# EAGLE design UCirKitUserStudy4-3 (EAGLE 7.3.0)
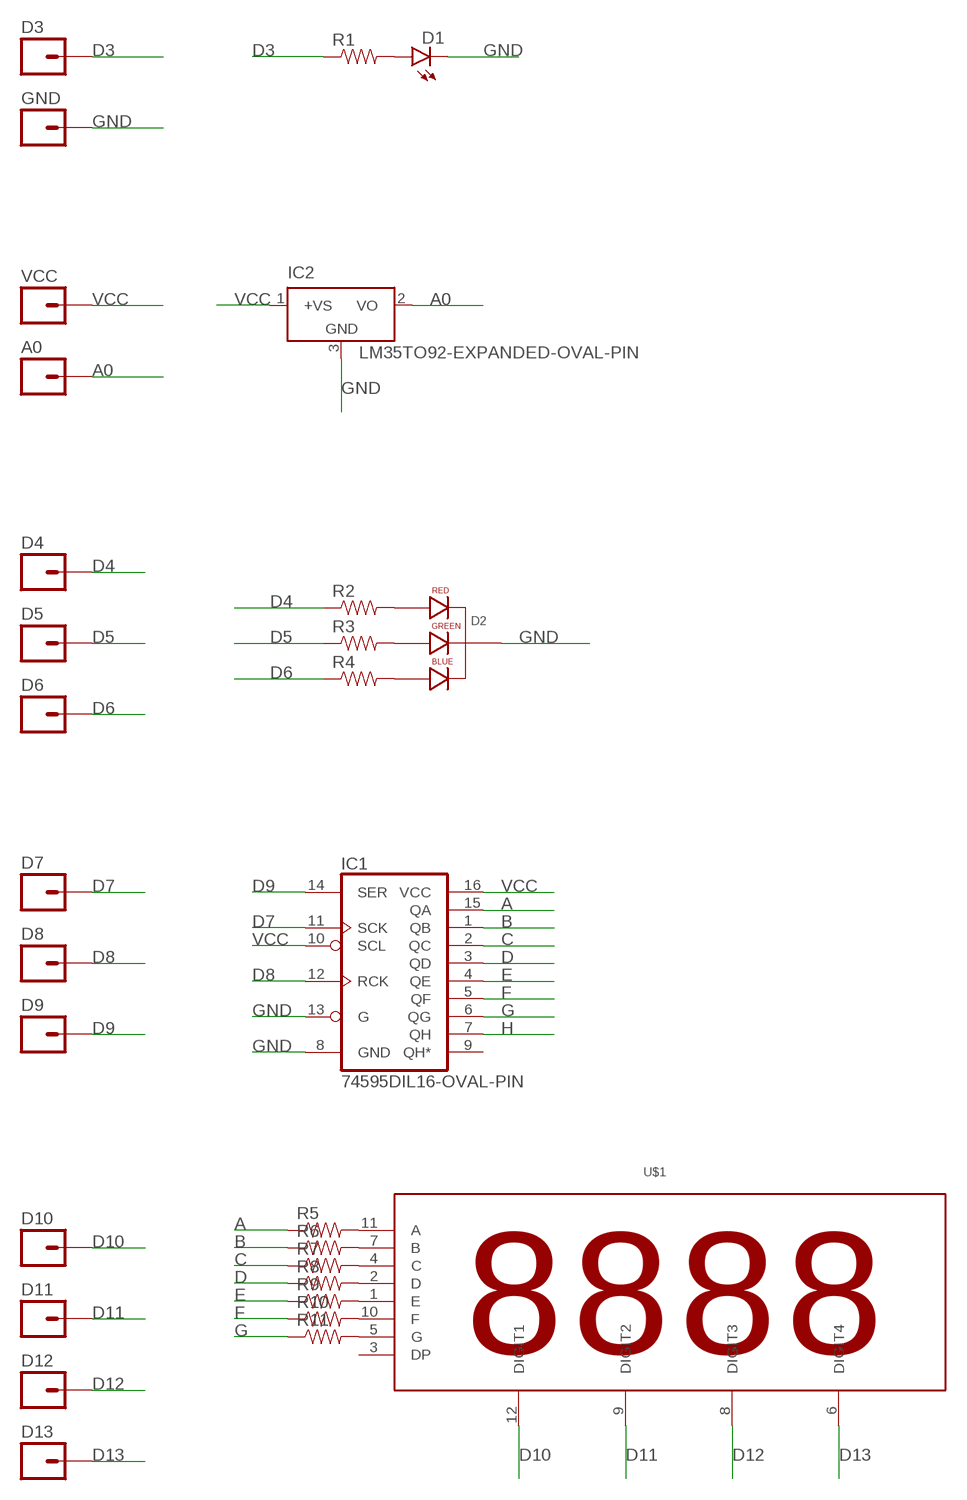
[diagram p0: schematic, sheet 1]

## Parts
A0  M01OVAL_PIN  [1X01_OVAL_PIN]
D1  LEDLED3MM-EXPANDED-OVAL-PIN  [LED3MM-EXPANDED-OVAL-PIN]
D2  LED-RGB-CC-THRULED-RGB-THRU-EXPANDED-OVAL-PIN  [LED-RGB-THRU-EXPANDED-OVAL-PIN]
D3  M01OVAL_PIN  [1X01_OVAL_PIN]
D4  M01OVAL_PIN  [1X01_OVAL_PIN]
D5  M01OVAL_PIN  [1X01_OVAL_PIN]
D6  M01OVAL_PIN  [1X01_OVAL_PIN]
D7  M01OVAL_PIN  [1X01_OVAL_PIN]
D8  M01OVAL_PIN  [1X01_OVAL_PIN]
D9  M01OVAL_PIN  [1X01_OVAL_PIN]
D10  M01OVAL_PIN  [1X01_OVAL_PIN]
D11  M01OVAL_PIN  [1X01_OVAL_PIN]
D12  M01OVAL_PIN  [1X01_OVAL_PIN]
D13  M01OVAL_PIN  [1X01_OVAL_PIN]
GND  M01OVAL_PIN  [1X01_OVAL_PIN]
IC1  74595DIL16-OVAL-PIN  [DIL16-OVAL-PIN]
IC2  LM35TO92-EXPANDED-OVAL-PIN  [TO92-EXPANDED-OVAL-PIN]
R1  1KOHM-1/4W-1%(PTH)PTH-EXPANDED-OVAL-PIN  [PTH-EXPANDED-OVAL-PIN]
R2  1KOHM-1/4W-1%(PTH)PTH-EXPANDED-OVAL-PIN  [PTH-EXPANDED-OVAL-PIN]
R3  1KOHM-1/4W-1%(PTH)PTH-EXPANDED-OVAL-PIN  [PTH-EXPANDED-OVAL-PIN]
R4  1KOHM-1/4W-1%(PTH)PTH-EXPANDED-OVAL-PIN  [PTH-EXPANDED-OVAL-PIN]
R5  1KOHM-1/4W-1%(PTH)PTH-EXPANDED-OVAL-PIN  [PTH-EXPANDED-OVAL-PIN]
R6  1KOHM-1/4W-1%(PTH)PTH-EXPANDED-OVAL-PIN  [PTH-EXPANDED-OVAL-PIN]
R7  1KOHM-1/4W-1%(PTH)PTH-EXPANDED-OVAL-PIN  [PTH-EXPANDED-OVAL-PIN]
R8  1KOHM-1/4W-1%(PTH)PTH-EXPANDED-OVAL-PIN  [PTH-EXPANDED-OVAL-PIN]
R9  1KOHM-1/4W-1%(PTH)PTH-EXPANDED-OVAL-PIN  [PTH-EXPANDED-OVAL-PIN]
R10  1KOHM-1/4W-1%(PTH)PTH-EXPANDED-OVAL-PIN  [PTH-EXPANDED-OVAL-PIN]
R11  1KOHM-1/4W-1%(PTH)PTH-EXPANDED-OVAL-PIN  [PTH-EXPANDED-OVAL-PIN]
U$1  4DIGIT_SEVEN_SEGMENT4DIGIT_SEVEN_SEGMENT_OVAL_PIN  [4DIGIT_SEVEN_SEGMENT_OVAL_PIN]
VCC  M01OVAL_PIN  [1X01_OVAL_PIN]

## Nets
A: IC1.15(QA) R5.P$1
A0: A0.1 IC2.2(VO)
B: IC1.1(QB) R6.P$1
C: IC1.2(QC) R7.P$1
D: IC1.3(QD) R8.P$1
D3: D3.1 R1.P$1
D4: D4.1 R2.P$1
D5: D5.1 R3.P$1
D6: D6.1 R4.P$1
D7: D7.1 IC1.11(SCK)
D8: D8.1 IC1.12(RCK)
D9: D9.1 IC1.14(SER)
D10: D10.1 U$1.12(DIGIT1)
D11: D11.1 U$1.9(DIGIT2)
D12: D12.1 U$1.8(DIGIT3)
D13: D13.1 U$1.6(DIGIT4)
E: IC1.4(QE) R9.P$1
F: IC1.5(QF) R10.P$1
G: IC1.6(QG) R11.P$1
GND: D1.K(C) D2.2(CATHODE) GND.1 IC1.8(GND) IC1.13(G) IC2.3(GND)
H: IC1.7(QH)
N$1: D1.A R1.P$2
N$2: D2.1(RED_CATHODE) R2.P$2
N$3: D2.3(GREEN_CATHODE) R3.P$2
N$4: D2.4(BLUE_CATHODE) R4.P$2
N$5: R5.P$2 U$1.11(A)
N$6: R6.P$2 U$1.7(B)
N$7: R7.P$2 U$1.4(C)
N$8: R8.P$2 U$1.2(D)
N$9: R9.P$2 U$1.1(E)
N$10: R10.P$2 U$1.10(F)
N$11: R11.P$2 U$1.5(G)
VCC: IC1.10(SCL) IC1.16(VCC) IC2.1(+VS) VCC.1
Unconnected: IC1.9(QH*) U$1.3(DP)

## Library data of the parts
A0 D3-D13 GND VCC = SparkFun-Connectors:M01: Header 1 Standard 1-pin 0.1" header. Use with straight break away headers (SKU : PRT-00116), right angle break away headers (PRT-00553), swiss pins (PRT-00743), machine pins (PRT-00117), and female headers (PRT-00115).
D1 = SparkFun-LED:LED: LEDs Standard schematic elements and footprints for 5mm, 3mm, 1206, and 0603 sized LEDs. 5mm - Spark Fun Electronics SKU : COM-00529 (and others)
D2 = SparkFun-LED:LED-RGB-CC-THRU: RGB Through-hole common cathode LED SparkFun Storefront: COM-00105 (Clear) COM-09264 (Diffuse)
IC1 = SparkFun-DigitalIC:74*595: 8-bit SHIFT REGISTER, output latch
IC2 = lm35:LM35: Single-Supply Centigrade Temperature Sensor Vout = (10mV/°C x Temp °C) +5mmmV Source: http://www.national.com/ds/LM/LM35.pdf
R1-R11 = SparkFun-Resistors:1KOHM-1/4W-1%(PTH): RES-12182
U$1 = led-7-segment:4DIGIT_SEVEN_SEGMENT

## Board
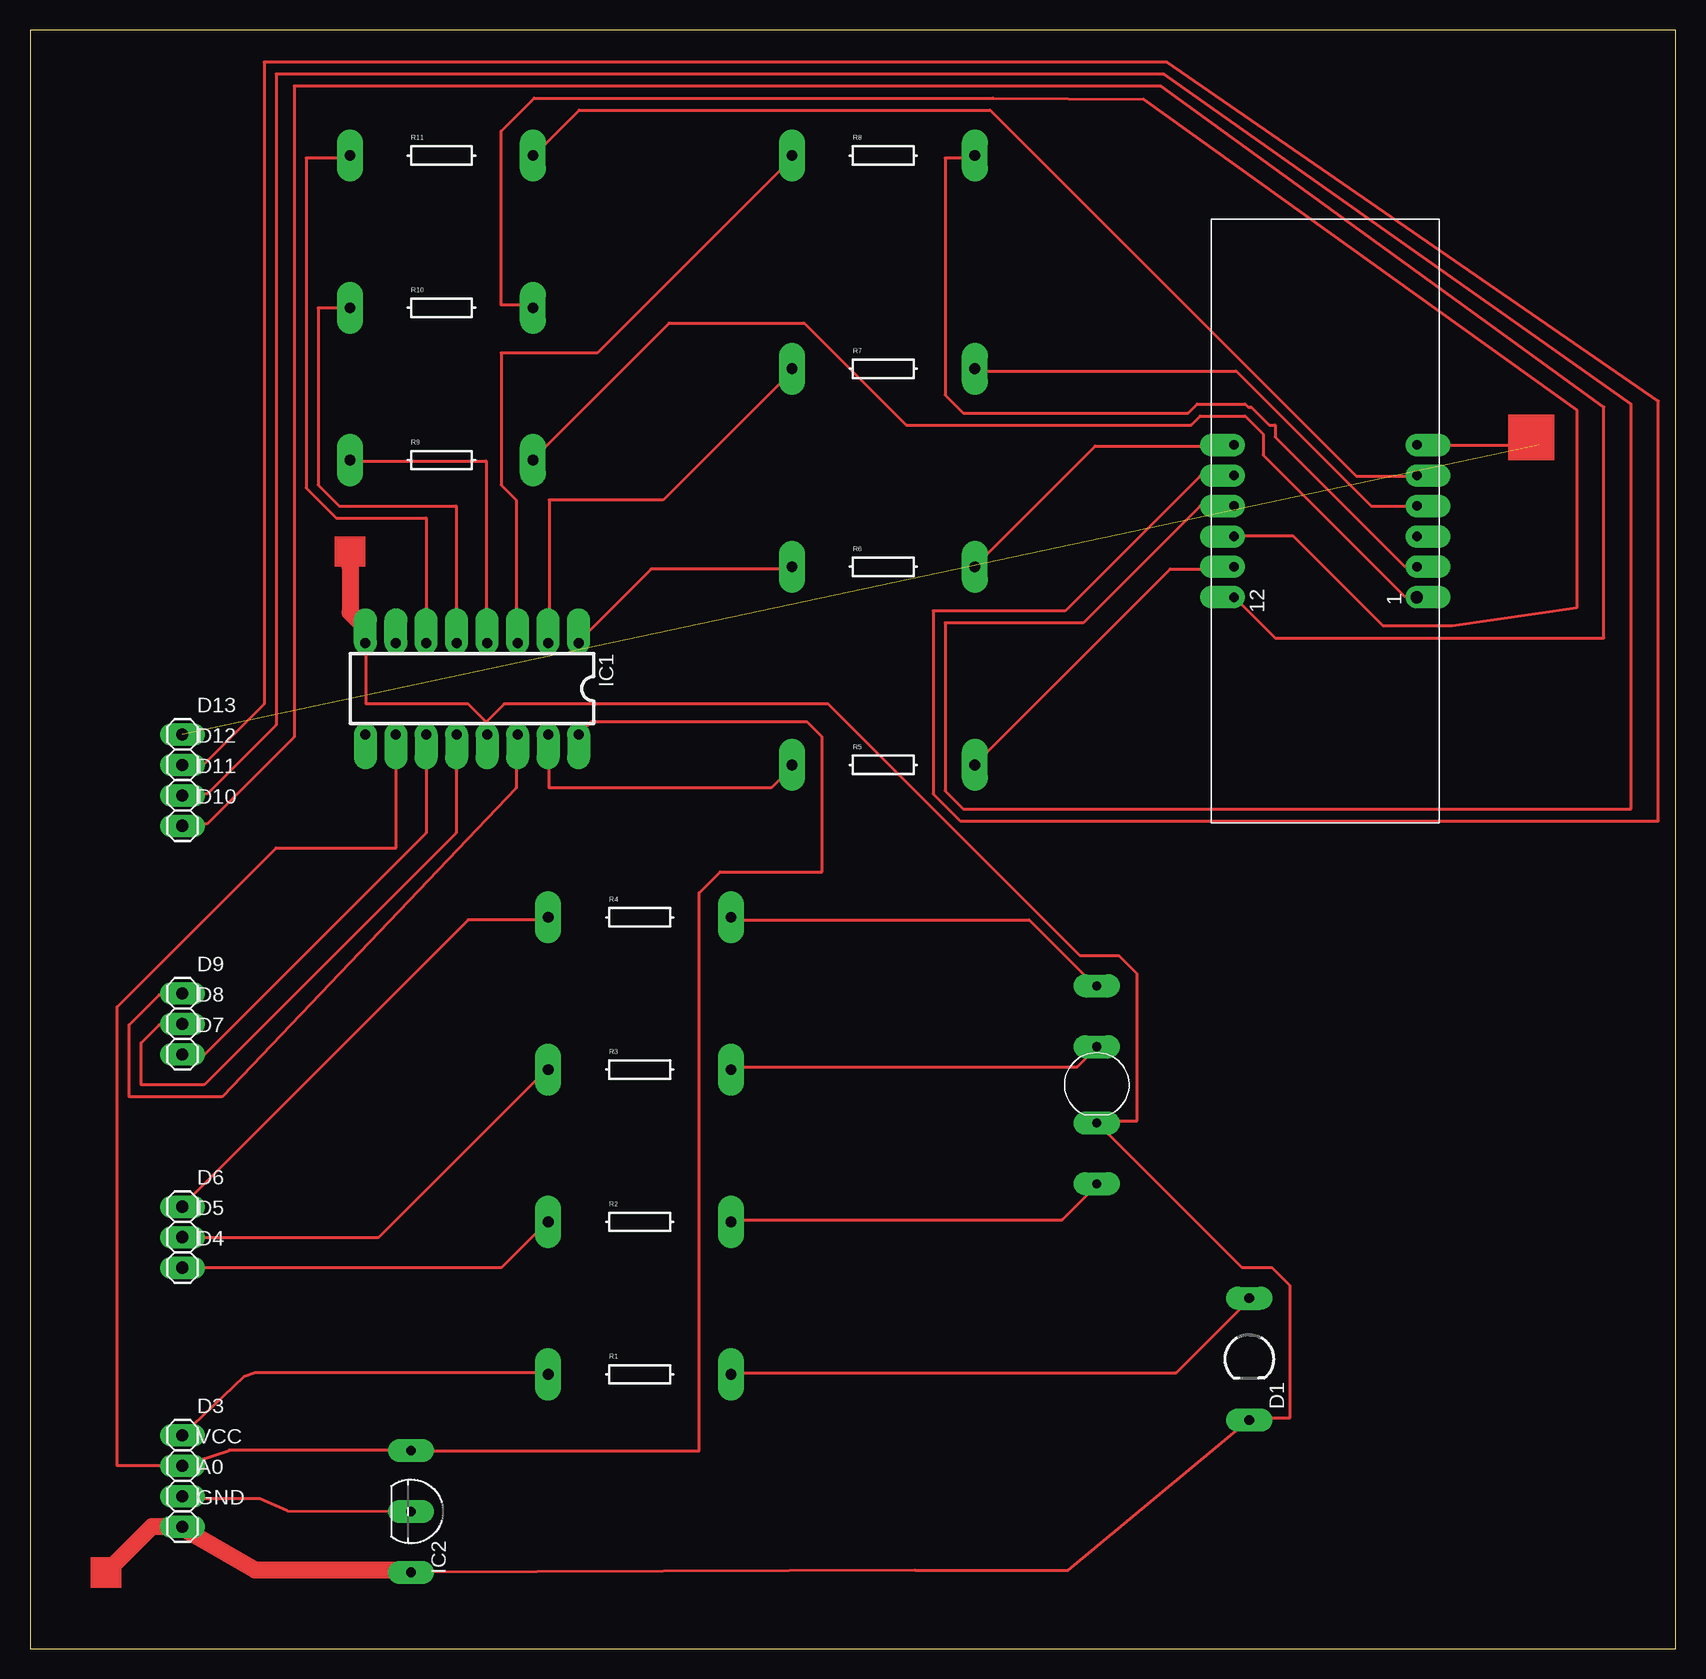
[diagram p1: board, top side]

Size 137.14 x 134.92 mm. Coordinates in mm from the lower left corner, seen from the top.
Outline: 0,0 137.14,0 137.14,134.92 0,134.92 0,0
Copper layers (1*16): Top 0.035mm / dielectric 1.5mm / Bottom 0.035mm
Design rules "default *": minimum track width 10mil, minimum drill 24mil, track to track 20mil, track to pad 50mil, pad to pad 9mil, via to via 9mil, smd to smd 8mil, copper to edge 40mil, drill to drill 8mil, minimum pad ring 10mil, minimum via ring 8mil, stop-mask expansion 4mil, vias tented up to drill 0mil, thermal gap 10mil

### Footprints (pad centres in the part's own frame; a part is rotated, then mirrored left to right if it is on the bottom)
1X01_OVAL_PIN = drill 1.016 pad 1.88 long: 1 0,0
LED3MM-EXPANDED-OVAL-PIN = drill 0.813 pad 1.93 long: A -5.08,0; K 5.08,0
LED-RGB-THRU-EXPANDED-OVAL-PIN = drill 0.762 pad 1.93 long: 1 8.255,0; 2 3.175,0; 3 -3.175,0; 4 -8.255,0
DIL16-OVAL-PIN = drill 0.813 pad 1.93 offset: 1 -8.89,-3.81; 2 -6.35,-3.81; 3 -3.81,-3.81; 4 -1.27,-3.81; 5 1.27,-3.81; 6 3.81,-3.81; 7 6.35,-3.81; 8 8.89,-3.81; 9 8.89,3.81; 10 6.35,3.81; 11 3.81,3.81; 12 1.27,3.81; 13 -1.27,3.81; 14 -3.81,3.81; 15 -6.35,3.81; 16 -8.89,3.81
TO92-EXPANDED-OVAL-PIN = drill 0.813 pad 1.93 long: 1 -5.08,0; 2 0,0; 3 5.08,0
PTH-EXPANDED-OVAL-PIN = drill 0.9 pad 2.184 long: P$1 -7.62,0; P$2 7.62,0
4DIGIT_SEVEN_SEGMENT_OVAL_PIN = drill 1.016 pad 1.88 offset: 1 -6.35,-7.62 | drill 0.8 pad 1.88 offset: 2 -3.81,-7.62; 3 -1.27,-7.62; 4 1.27,-7.62; 5 3.81,-7.62; 6 6.35,-7.62; 7 6.35,7.62; 8 3.81,7.62; 9 1.27,7.62; 10 -1.27,7.62; 11 -3.81,7.62; 12 -6.35,7.62

### Placement (x,y rotation side)
A0  12.7,12.7 0 top
D1  101.6,24.13 270 top
D2  88.9,46.99 270 top
D3  12.7,17.78 0 top
D4  12.7,31.75 0 top
D5  12.7,34.29 0 top
D6  12.7,36.83 0 top
D7  12.7,49.53 0 top
D8  12.7,52.07 0 top
D9  12.7,54.61 0 top
D10  12.7,68.58 0 top
D11  12.7,71.12 0 top
D12  12.7,73.66 0 top
D13  12.7,76.2 0 top
GND  12.7,10.16 0 top
IC1  36.83,80.01 180 top
IC2  31.75,11.43 270 top
R1  50.8,22.86 0 top
R2  50.8,35.56 0 top
R3  50.8,48.26 0 top
R4  50.8,60.96 0 top
R5  71.12,73.66 0 top
R6  71.12,90.17 0 top
R7  71.12,106.68 0 top
R8  71.12,124.46 0 top
R9  34.29,99.06 0 top
R10  34.29,111.76 0 top
R11  34.29,124.46 0 top
U$1  107.95,93.98 90 top
VCC  12.7,15.24 0 top

### Tracks (layer width: path | path; a pad name or v marks a point on that pad's centre or on a via)
A
  Top 0.254: IC1.15 43.25,76 43.25,71.75 61.75,71.75 63.5,73.5 R5.P$1
A0
  Top 0.254: A0.1 12.75,12.5 19.16,12.5 21.43,11.5 IC2.2
B
  Top 0.254: IC1.1 45.75,84 51.75,90 63.5,90 R6.P$1
C
  Top 0.254: IC1.2 43.25,84 43.25,95.75 52.75,95.75 63.5,106.5 R7.P$1
D
  Top 0.254: IC1.3 40.5,84 40.5,95.75 39.25,97 39.25,108 47.25,108 63.5,124.25 R8.P$1
D3
  Top 0.254: D3.1 17.83,22.65 18.75,23 43,23 R1.P$1
D4
  Top 0.254: D4.1 39.25,31.75 43,35.5 R2.P$1
D5
  Top 0.254: D5.1 12.75,34.25 29,34.25 43,48.25 R3.P$1
D6
  Top 0.254: D6.1 12.75,37 36.5,60.75 43,60.75 R4.P$1
D7
  Top 0.254: D7.1 12.75,49.5 14.5,49.5 33,68 33,76 IC1.11
D8
  Top 0.254: D8.1 12.5,52 10.75,52 9.25,50.5 9.25,47 14.5,47 35.5,68 35.5,76 IC1.12
D9
  Top 0.254: D9.1 12.5,54.5 10.75,54.5 8.25,52 8.25,46 16.02,46 40.5,71.75 40.5,76 IC1.14
D10
  Top 0.254: D10.1 12.75,68.75 14.75,68.75 22,76 22,130.25 94.25,130.25 131.16,103.5 131.16,84.25 103.75,84.25 100.5,87.5 U$1.12
D11
  Top 0.254: U$1.9 97.5,95.25 87.75,85.5 76.25,85.5 76.25,71.5 77.75,70 133.43,70 133.43,103.75 94.5,131.25 20.5,131.25 20.5,77 14.75,71.25 12.75,71.25 D11.1
D12
  Top 0.254: D12.1 12.75,73.75 14.5,73.75 19.5,78.75 19.5,132.25 94.75,132.25 135.7,104 135.7,69 77.5,69 75.25,71.25 75.25,86.5 86.25,86.5 97.5,97.75 100.25,97.75 U$1.8
D13  (1 unrouted)
  Top 0.254: U$1.6 125.73,100.33
E
  Top 0.254: IC1.4 38,84 38,99 26.75,99 R9.P$1
F
  Top 0.254: IC1.5 35.5,84 35.5,95.25 25.75,95.25 24,97 24,111.75 26.5,111.75 R10.P$1
G
  Top 0.254: IC1.6 33,84 33,94.25 25.5,94.25 23,96.75 23,124.25 26.5,124.25 R11.P$1
GND
  Top 0.254: 38,77.25 36.5,78.75 28,78.75 28,83.75 IC1.8 | 38,77.25 38,76.25 IC1.13 | 12.75,10 GND.1 | 31.59,6.54 IC2.3 73.75,6.54 86.5,6.54 101.5,19 D1.K 101.75,19.25 105,19.25 105,30.25 103.5,31.75 101,31.75 89,43.75 D2.2 89,44 92.25,44 92.25,56.25 90.75,57.75 87.5,57.75 66.5,78.75 39.5,78.75 38,77.25
  Top 1.422: 12.75,10 18.75,6.54 31.59,6.54 | GND.1 10.16,10.16 6.35,6.35
N$1
  Top 0.254: D1.A 101.5,29 95.5,23 58.5,23 R1.P$2
N$2
  Top 0.254: D2.1 88.75,38.5 86,35.75 58.5,35.75 R2.P$2
N$3
  Top 0.254: D2.3 88.75,50 87.25,48.5 58.5,48.5 R3.P$2
N$4
  Top 0.254: D2.4 88.75,55.25 83.25,60.75 58.5,60.75 R4.P$2
N$5
  Top 0.254: U$1.11 100.25,90 95,90 78.75,73.75 R5.P$2
N$6
  Top 0.254: U$1.7 100.25,100.25 88.75,100.25 78.75,90.25 R6.P$2
N$7
  Top 0.254: U$1.4 111.75,95.25 100.5,106.5 78.75,106.5 R7.P$2
N$8
  Top 0.254: U$1.2 115.5,90.25 114.5,90.25 103.75,101 103.75,102 103.25,102 101.75,103.5 101.5,103.5 101.25,103.75 97.25,103.75 96.5,103 77.75,103 76.25,104.5 76.25,124.25 78.5,124.25 R8.P$2
N$9
  Top 0.254: U$1.1 115.5,87.75 114.5,87.75 102.75,99.5 102.75,101.25 101.25,102.75 97.5,102.75 96.75,102 73,102 64.5,110.5 53.25,110.5 42,99.25 R9.P$2
N$10
  Top 0.254: U$1.10 100.5,92.75 105.25,92.75 112.75,85.25 118.5,85.25 128.89,86.75 128.89,103.25 92.79,129.16 80.25,129.25 42,129.25 39.25,126.5 39.25,112 41.75,112 R10.P$2
N$11
  Top 0.254: U$1.5 115.5,97.75 110.5,97.75 80,128.25 45.75,128.25 42,124.5 R11.P$2
N$12
  Top 1.422: 26.67,90.17 26.67,86.36 27.94,85.09
VCC
  Top 0.254: IC1.10 30.5,76 30.5,66.75 20.5,66.75 7.25,53.5 7.25,15.25 12.5,15.25 VCC.1 12.75,15.25 16.5,16.46 16.55,16.51 IC2.1 31.8,16.46 55.75,16.46 55.75,63 57.5,64.75 66,64.75 66,76 64.75,77.25 46.75,77.25 45.75,76.25 IC1.16
(copper drawn outside any net)
  shapes: Top area x3